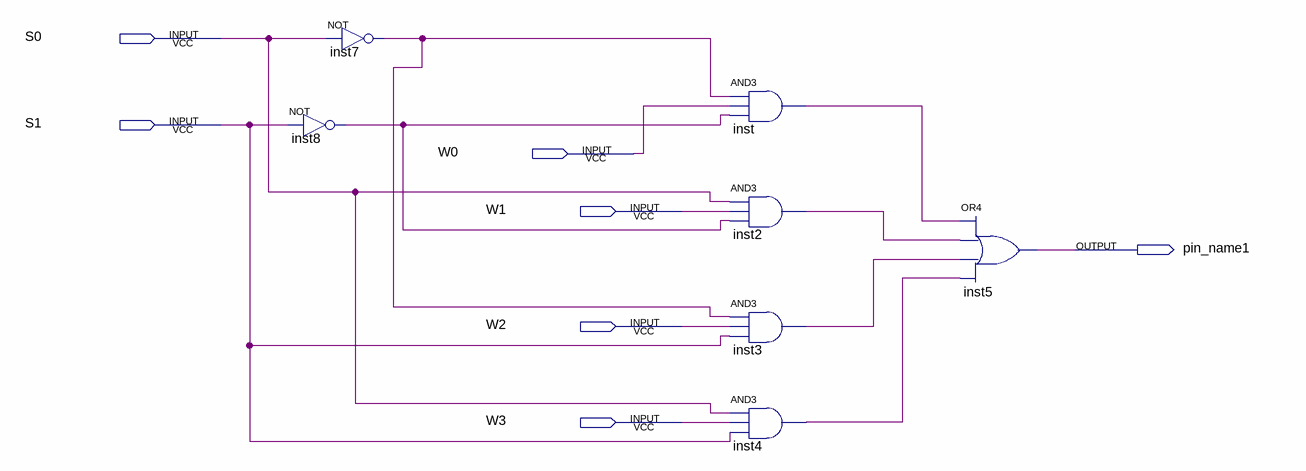
[diagram p0: schematic sheet]
// Quartus schematic 4BitMux.bdf as structural Verilog: 7 symbols, 7 pins
module \4BitMux  (
  input  S0,
  input  S1,
  input  W0,
  input  W1,
  input  W2,
  input  W3,
  output pin_name1
);

  wire inst2_out, inst3_out, inst4_out, inst7_out, inst8_out, inst_out;

  not inst7 (inst7_out, S0);
  not inst8 (inst8_out, S1);
  and inst (inst_out, inst7_out, W0, inst8_out);
  and inst2 (inst2_out, S0, W1, inst8_out);
  and inst3 (inst3_out, inst7_out, W2, S1);
  and inst4 (inst4_out, S0, W3, S1);
  or inst5 (pin_name1, inst_out, inst2_out, inst3_out, inst4_out);
endmodule
